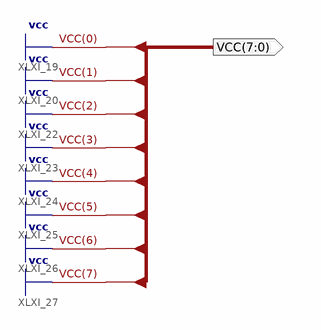
[diagram p0: schematic sheet 1]
// Xilinx ISE schematic vcc8.sch (spartan6) as structural Verilog: 0 symbols, 1 ports
module vcc8 (
  output [7:0] VCC
);


  assign VCC = {8{1'b1}};
endmodule
